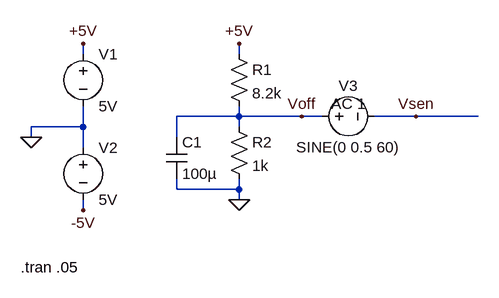
[diagram p0: schematic Av1a.asc]
Av1a.asc, the LTspice schematic file:
Version 4
SHEET 1 1632 680
WIRE -384 -224 -384 -240
WIRE -144 -224 -144 -240
WIRE -144 -128 -144 -144
WIRE -144 -128 -240 -128
WIRE -48 -128 -144 -128
WIRE -16 -128 -48 -128
WIRE 128 -128 64 -128
WIRE 224 -128 128 -128
WIRE -384 -112 -384 -144
WIRE -384 -112 -464 -112
WIRE -144 -112 -144 -128
WIRE -464 -96 -464 -112
WIRE -240 -96 -240 -128
WIRE -384 -80 -384 -112
WIRE -240 -16 -240 -32
WIRE -144 -16 -144 -32
WIRE -144 -16 -240 -16
WIRE -144 0 -144 -16
WIRE -384 16 -384 0
FLAG -464 -96 0
FLAG -384 -240 +5V
FLAG -384 16 -5V
FLAG -144 0 0
FLAG -144 -240 +5V
FLAG 128 -128 Vsen
FLAG -48 -128 Voff
SYMBOL voltage -384 -240 R0
WINDOW 123 0 0 Left 0
WINDOW 39 0 0 Left 0
SYMATTR InstName V1
SYMATTR Value 5V
SYMBOL voltage -384 -96 R0
WINDOW 123 0 0 Left 0
WINDOW 39 0 0 Left 0
SYMATTR InstName V2
SYMATTR Value 5V
SYMBOL res -160 -240 R0
SYMATTR InstName R1
SYMATTR Value 8.2k
SYMBOL res -160 -128 R0
SYMATTR InstName R2
SYMATTR Value 1k
SYMBOL cap -256 -96 R0
SYMATTR InstName C1
SYMATTR Value 100µ
SYMBOL voltage -32 -128 R270
WINDOW 0 32 56 VTop 2
WINDOW 3 -32 56 VBottom 2
WINDOW 123 4 56 VTop 2
WINDOW 39 0 0 Left 0
SYMATTR InstName V3
SYMATTR Value SINE(0 0.5 60)
SYMATTR Value2 AC 1
TEXT -480 104 Left 2 !.tran .05

The netlist it stands for:
* Av1a.asc
V1 +5V 0 5V
V2 0 -5V 5V
R1 +5V Voff 8.2k
R2 Voff 0 1k
C1 Voff 0 100µ
V3 Voff Vsen SINE(0 0.5 60) AC 1
.tran .05
.backanno
.end